# EAGLE design Autopilot Control Unit rev3 (EAGLE 9.6.2)
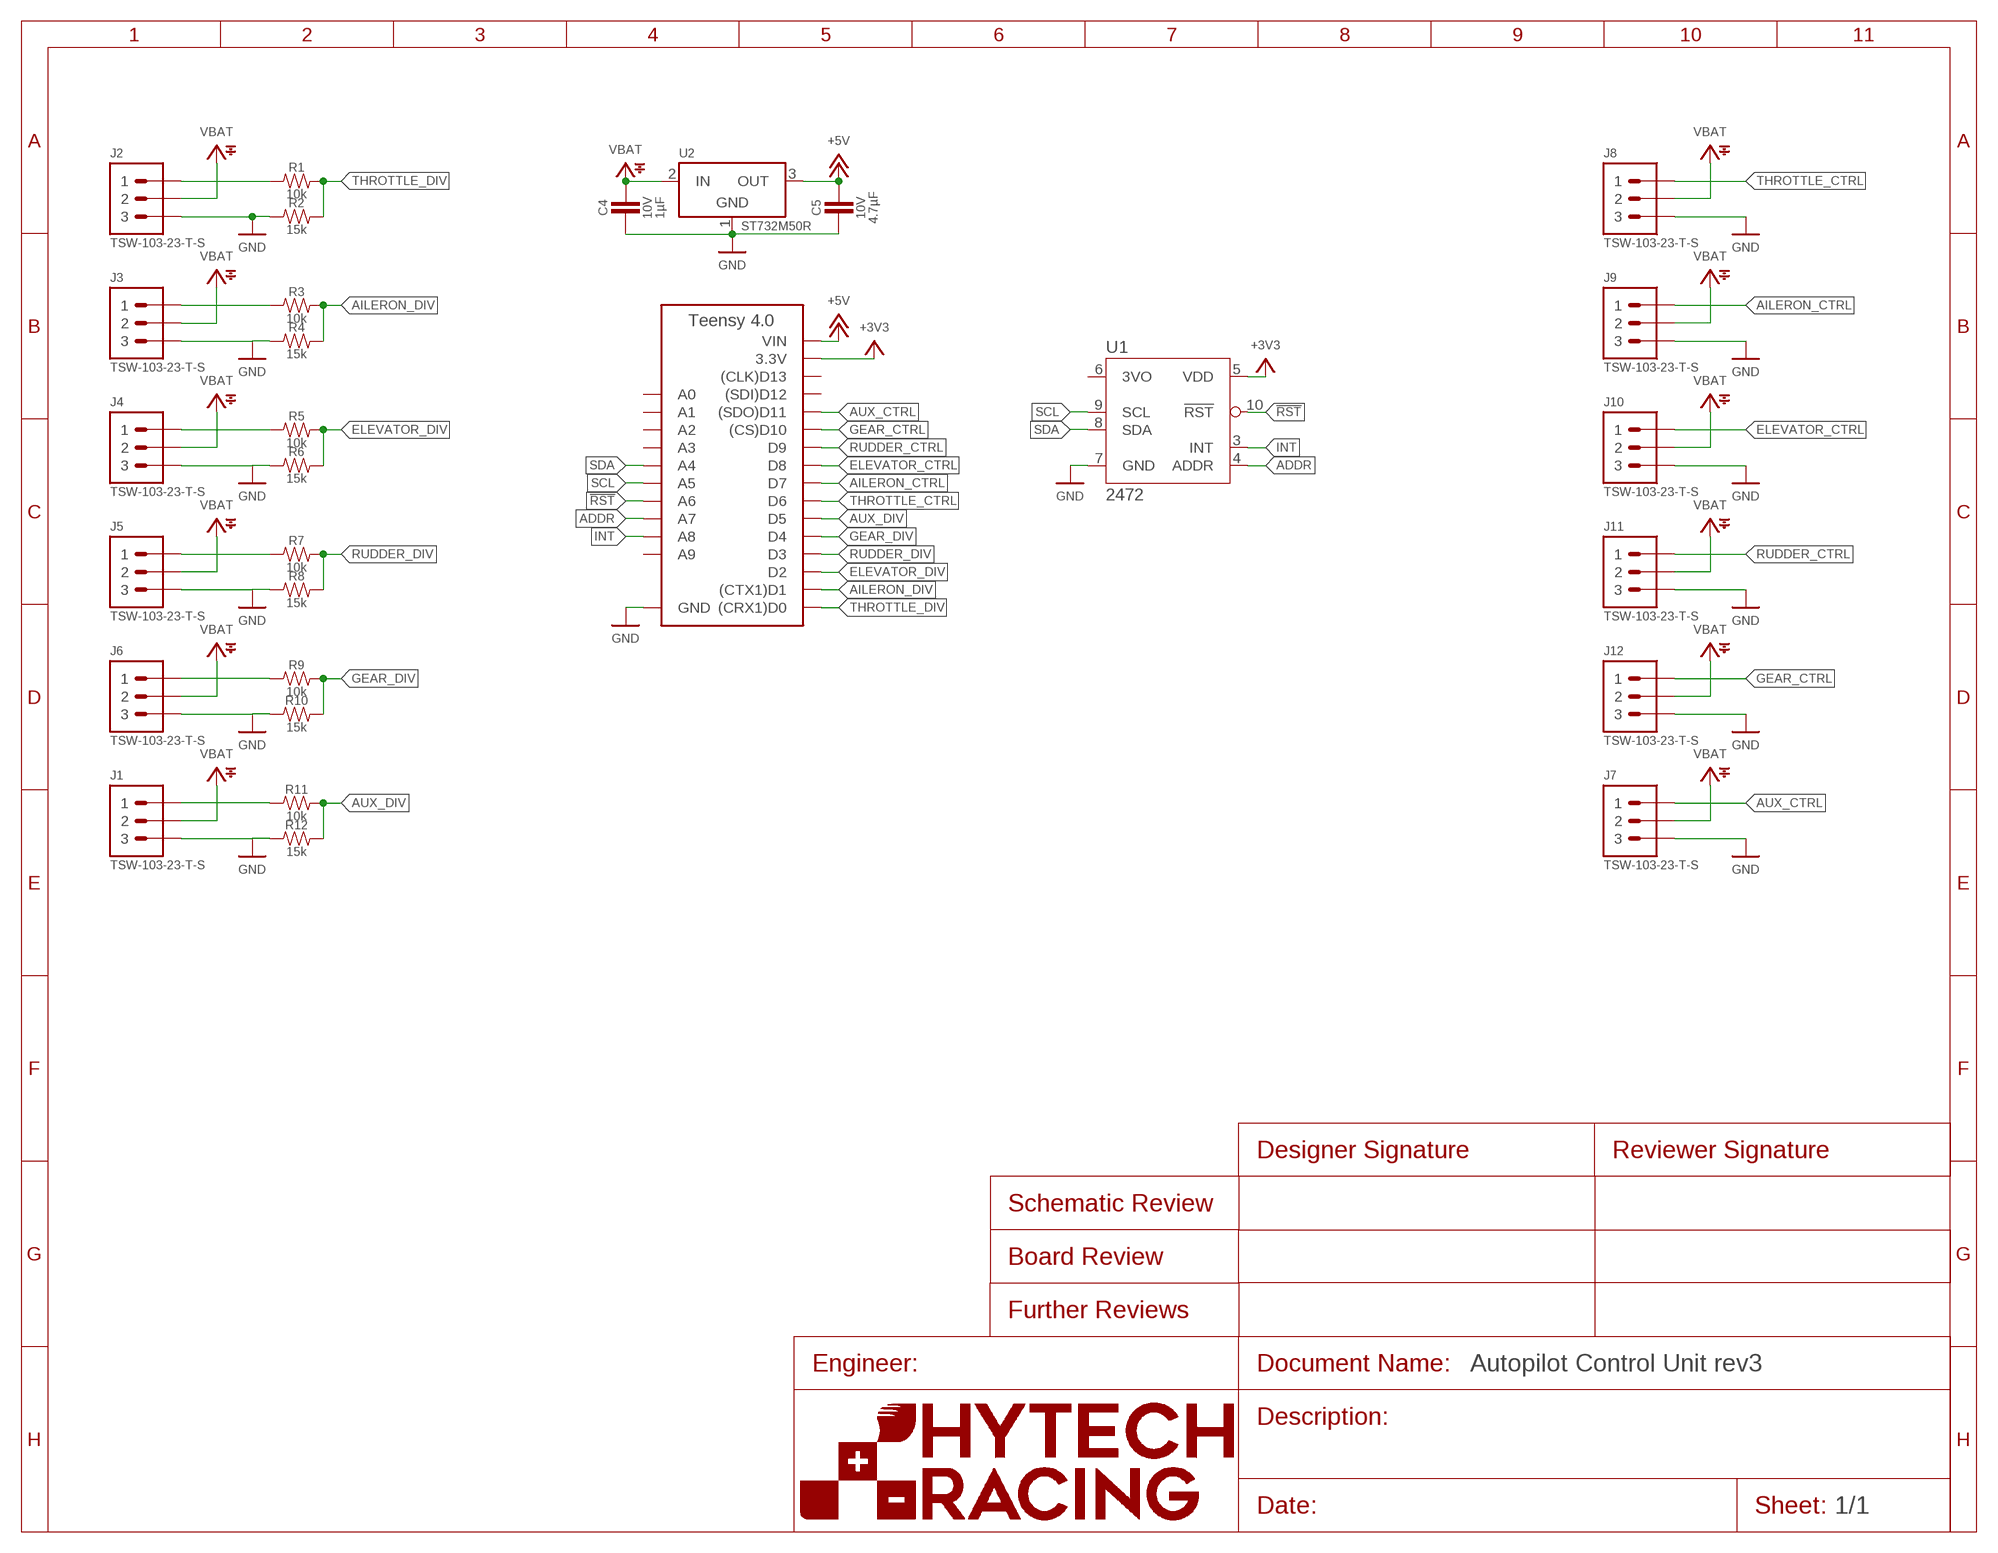
[diagram p0: schematic, sheet 1]

## Parts
A1  TEENSY_4.0TH  [TEENSY_SHORT]
C4  CAPACITOR_0603_10V_1UF  [0603-CAP]
C5  CAPACITOR_0603_10V_4.7UF  [0603-CAP]
J1  CONNECTOR_3__0.1"_INCH_TH  [0.1"_TH_HEADER]
J2  CONNECTOR_3__0.1"_INCH_TH  [0.1"_TH_HEADER]
J3  CONNECTOR_3__0.1"_INCH_TH  [0.1"_TH_HEADER]
J4  CONNECTOR_3__0.1"_INCH_TH  [0.1"_TH_HEADER]
J5  CONNECTOR_3__0.1"_INCH_TH  [0.1"_TH_HEADER]
J6  CONNECTOR_3__0.1"_INCH_TH  [0.1"_TH_HEADER]
J7  CONNECTOR_3__0.1"_INCH_TH  [0.1"_TH_HEADER]
J8  CONNECTOR_3__0.1"_INCH_TH  [0.1"_TH_HEADER]
J9  CONNECTOR_3__0.1"_INCH_TH  [0.1"_TH_HEADER]
J10  CONNECTOR_3__0.1"_INCH_TH  [0.1"_TH_HEADER]
J11  CONNECTOR_3__0.1"_INCH_TH  [0.1"_TH_HEADER]
J12  CONNECTOR_3__0.1"_INCH_TH  [0.1"_TH_HEADER]
R1  RESISTOR_0603_10K  [0603-RES]
R2  RESISTOR_0603_15K  [0603-RES]
R3  RESISTOR_0603_10K  [0603-RES]
R4  RESISTOR_0603_15K  [0603-RES]
R5  RESISTOR_0603_10K  [0603-RES]
R6  RESISTOR_0603_15K  [0603-RES]
R7  RESISTOR_0603_10K  [0603-RES]
R8  RESISTOR_0603_15K  [0603-RES]
R9  RESISTOR_0603_10K  [0603-RES]
R10  RESISTOR_0603_15K  [0603-RES]
R11  RESISTOR_0603_10K  [0603-RES]
R12  RESISTOR_0603_15K  [0603-RES]
U1  ADAFRUIT_BNO055  [ADAFRUIT_BNO055]
U2  VOLTAGE_REGULATOR_SOT-23-5_5V  [SOT-23-5]

## Nets
!RST: A1.D20(A6) U1.10(!RST)
+3V3: A1.3.3V U1.5(VDD)
+5V: A1.VIN C5.1 U2.3(OUT)
ADDR: A1.D21(A7) U1.4(ADDR)
AILERON_CTRL: A1.D7 J9.1
AILERON_DIV: A1.D1((CTX1)D1) R3.2 R4.2
AILERON_IN: J3.1 R3.1
AUX_CTRL: A1.D11((SDO)D11) J7.1
AUX_DIV: A1.D5 R11.2 R12.2
AUX_IN: J1.1 R11.1
ELEVATOR_CTRL: A1.D8 J10.1
ELEVATOR_DIV: A1.D2 R5.2 R6.2
ELEVATOR_IN: J4.1 R5.1
GEAR_CTRL: A1.D10((CS)D10) J12.1
GEAR_DIV: A1.D4 R9.2 R10.2
GEAR_IN: J6.1 R9.1
GND: A1.AGND/GND(GND) A1.GND C4.2 C5.2 J1.3 J2.3 J3.3 J4.3 J5.3 J6.3 J7.3 J8.3 J9.3 J10.3 J11.3 J12.3 R2.1 R4.1 R6.1 R8.1 R10.1 R12.1 U1.7(GND) U2.1(GND)
INT: A1.D22(A8) U1.3(INT)
RUDDER_CTRL: A1.D9 J11.1
RUDDER_DIV: A1.D3 R7.2 R8.2
RUDDER_IN: J5.1 R7.1
SCL: A1.D19(A5) U1.9(SCL)
SDA: A1.D18(A4) U1.8(SDA)
THROTTLE_CTRL: A1.D6 J8.1
THROTTLE_DIV: A1.D0((CRX1)D0) R1.2 R2.2
THROTTLE_IN: J2.1 R1.1
VBAT: C4.1 J1.2 J2.2 J3.2 J4.2 J5.2 J6.2 J7.2 J8.2 J9.2 J10.2 J11.2 J12.2 U2.2(IN)
Unconnected: A1.D12((SDI)D12) A1.D13((CLK)D13) A1.D14(A0) A1.D15(A1) A1.D16(A2) A1.D17(A3) A1.D23(A9)

## Power pins joined to a net without a drawn wire
3VO: U1.6(3VO)

## Library data of the parts
A1 = HyTechDevices:TEENSY_4.0: Teensy 4.0 Datasheet <https://www.pjrc.com/store/teensy40.html> Requires ordering of: 2: 14 pin, 0.1" pitch female headers. Recommend Samtec SSM-114-L-SV for surface mount variant.; TEENSY: 4.0
C4 = HyTechDevices:CAPACITOR_?_*: Capacitor, Non-Polarized VJ...1BC Series Datasheet <https://www.mouser.com/datasheet/2/427/vjw1bcbascomseries-1762447.pdf> Samsung Datasheet <https://www.mouser.com/datasheet/2/585/MLCC-1837944.pdf> Walsin Datasheet <https://www.mouser.com/datasheet/2/210/WTC_MLCC_General_Purpose-1534899.pdf> GRM188R61A226ME15D <https://www.mouser.com/datasheet/2/281/1/GRM188R61A226ME15_02A-1985787.pdf> GRM188R61E106MA73D <https://www.mouser.com/datasheet/2/281/1/GRM188R61E106MA73_01A-1985806.pdf> 885012006013 <https://www.mouser.com/datasheet/2/445/885012006013-1726946.pdf> 2220Y6300105KXTWS2 <https://www.mouser.com/datasheet/2/218/SMD_High_and_Std_StackiCap_P62-1825512.pdf> Yageo Class 2, X5R <https://www.mouser.com/datasheet/2/447/UPY_GPHC_X5R_4V_to_50V_26-1827097.pdf> TDK C Series <https://www.mouser.com/ProductDetail/TDK/C3216X5R1V226M160AC?qs=%2Fha2pyFadujbcx9jh7lYl%2F4NeMoXFhdc8AqVWNq4wW6M2y7zl6GzBuhgtI0ngznN> AVX Automotive MLCC <https://www.mouser.com/datasheet/2/40/AutoMLCC-777028.pdf> KEMET X7R Series <https://www.mouser.com/datasheet/2/212/KEM_C1002_X7R_SMD-1102033.pdf> Kyocera AVX <https://www.mouser.com/datasheet/2/40/C0GNP0_Dielectric-951274.pdf> GRM21BR61H <https://www.mouser.com/datasheet/2/281/1/GRM21BR61H106KE43_01A-1986884.pdf>; CAPACITANCE: 1µF; DKPN: 311-1796-1-ND; MANUFACTURER: Yageo; MOPN: 603-CC603KRX7R6BB105; MPN: CC0603KRX7R6BB105; TOLERANCE: 10%; VOLTAGE: 10V
C5 = HyTechDevices:CAPACITOR_?_*: Capacitor, Non-Polarized VJ...1BC Series Datasheet <https://www.mouser.com/datasheet/2/427/vjw1bcbascomseries-1762447.pdf> Samsung Datasheet <https://www.mouser.com/datasheet/2/585/MLCC-1837944.pdf> Walsin Datasheet <https://www.mouser.com/datasheet/2/210/WTC_MLCC_General_Purpose-1534899.pdf> GRM188R61A226ME15D <https://www.mouser.com/datasheet/2/281/1/GRM188R61A226ME15_02A-1985787.pdf> GRM188R61E106MA73D <https://www.mouser.com/datasheet/2/281/1/GRM188R61E106MA73_01A-1985806.pdf> 885012006013 <https://www.mouser.com/datasheet/2/445/885012006013-1726946.pdf> 2220Y6300105KXTWS2 <https://www.mouser.com/datasheet/2/218/SMD_High_and_Std_StackiCap_P62-1825512.pdf> Yageo Class 2, X5R <https://www.mouser.com/datasheet/2/447/UPY_GPHC_X5R_4V_to_50V_26-1827097.pdf> TDK C Series <https://www.mouser.com/ProductDetail/TDK/C3216X5R1V226M160AC?qs=%2Fha2pyFadujbcx9jh7lYl%2F4NeMoXFhdc8AqVWNq4wW6M2y7zl6GzBuhgtI0ngznN> AVX Automotive MLCC <https://www.mouser.com/datasheet/2/40/AutoMLCC-777028.pdf> KEMET X7R Series <https://www.mouser.com/datasheet/2/212/KEM_C1002_X7R_SMD-1102033.pdf> Kyocera AVX <https://www.mouser.com/datasheet/2/40/C0GNP0_Dielectric-951274.pdf> GRM21BR61H <https://www.mouser.com/datasheet/2/281/1/GRM21BR61H106KE43_01A-1986884.pdf>; CAPACITANCE: 4.7µF; DKPN: 1276-1044-1-ND; MANUFACTURER: Samsung Electro-Mechanics; MOPN: 187-CL10A475KP8NNNC; MPN: CL10A475KP8NNNC; TOLERANCE: 10%; VOLTAGE: 10V
J1-J12 = Devices:CONNECTOR_3_?_*; MPN: TSW-103-23-T-S
R1 R3 R5 R7 R9 R11 = HyTechDevices:RESISTOR_?_*: Resistor PWR163 Series <https://www.mouser.com/datasheet/2/54/pwr163-777985.pdf> AC Series <https://www.mouser.com/datasheet/2/447/Yageo_PYu_AC_51_RoHS_L_7_1714230-1874691.pdf> PU Series <https://www.mouser.com/datasheet/2/447/PYu-PU_51_RoHS_L_6-1504619.pdf> ERA Series <https://www.mouser.com/datasheet/2/315/AOA0000C307-1149632.pdf> PWR263 Series <https://www.mouser.com/datasheet/2/54/pwr263s_35-778069.pdf> KTR Series <https://www.mouser.com/datasheet/2/348/ROHM_S_A0011075115_1-2563276.pdf> RC Series <https://www.mouser.com/datasheet/2/447/Yageo_03_18_2021_PYu_RC_Group_51_RoHS_L_11-2199992.pdf> ERJ PB3, PB6 Series <https://www.mouser.com/datasheet/2/315/AOA0000C328-1530132.pdf> ERJ PA2, P03, PA3, P06, P08, P14 Series <https://www.mouser.com/datasheet/2/315/AOA0000C331-1141874.pdf> B20 Series <https://www.ohmite.com/assets/docs/res_200.pdf?r=false> TE Connectivity/Holsworthy RN73 Series <https://www.mouser.com/datasheet/2/418/4/NG_DS_1773270_M-604713.pdf> Vishay Dale D/CRCW e3 <https://www.mouser.com/datasheet/2/427/dcrcwe3-1762152.pdf> Ohmite B20 <https://www.ohmite.com/assets/docs/res_200.pdf?r=false>; DKPN: 311-10.0KHRCT-ND; MANUFACTURER: Yageo; MOPN: 603-RC0603FR-0710KL; MPN: RC0603FR-0710KL; POWER: 0.1W; RESISTANCE: 10k; TOLERANCE: 1%; VOLTAGE_CONTINUOUS: 31.62V; VOLTAGE_MAX: 75V
R2 R4 R6 R8 R10 R12 = HyTechDevices:RESISTOR_?_*: Resistor PWR163 Series <https://www.mouser.com/datasheet/2/54/pwr163-777985.pdf> AC Series <https://www.mouser.com/datasheet/2/447/Yageo_PYu_AC_51_RoHS_L_7_1714230-1874691.pdf> PU Series <https://www.mouser.com/datasheet/2/447/PYu-PU_51_RoHS_L_6-1504619.pdf> ERA Series <https://www.mouser.com/datasheet/2/315/AOA0000C307-1149632.pdf> PWR263 Series <https://www.mouser.com/datasheet/2/54/pwr263s_35-778069.pdf> KTR Series <https://www.mouser.com/datasheet/2/348/ROHM_S_A0011075115_1-2563276.pdf> RC Series <https://www.mouser.com/datasheet/2/447/Yageo_03_18_2021_PYu_RC_Group_51_RoHS_L_11-2199992.pdf> ERJ PB3, PB6 Series <https://www.mouser.com/datasheet/2/315/AOA0000C328-1530132.pdf> ERJ PA2, P03, PA3, P06, P08, P14 Series <https://www.mouser.com/datasheet/2/315/AOA0000C331-1141874.pdf> B20 Series <https://www.ohmite.com/assets/docs/res_200.pdf?r=false> TE Connectivity/Holsworthy RN73 Series <https://www.mouser.com/datasheet/2/418/4/NG_DS_1773270_M-604713.pdf> Vishay Dale D/CRCW e3 <https://www.mouser.com/datasheet/2/427/dcrcwe3-1762152.pdf> Ohmite B20 <https://www.ohmite.com/assets/docs/res_200.pdf?r=false>; DKPN: P15KBDCT-ND; MANUFACTURER: Panasonic Electronic Components; MOPN: 667-ERA-3ARB153V; MPN: ERA-3ARB153V; POWER: 0.1W; RESISTANCE: 15k; TOLERANCE: 0.1%; VOLTAGE_CONTINUOUS: 38.73V; VOLTAGE_MAX: 75V
U1 = Devices:ADAFRUIT_BNO055: Adafruit 9-DOF Absolute Orientation IMU Fusion Breakout - BNO055 <https://www.adafruit.com/product/2472#technical-details>; MPN: 2472
U2 = HyTechDevices:VOLTAGE_REGULATOR_?_*: Voltage Regulators LDL1117S50R Datasheet <https://www.mouser.com/datasheet/2/389/dm00366442-1799212.pdf> NCP785AH120T1G <https://www.mouser.com/datasheet/2/308/NCP785A_D-1812704.pdf> LMS8117A Datasheet <https://www.ti.com/lit/ds/symlink/lms8117a.pdf?HQS> ST732M50R Datasheet <https://www.mouser.com/datasheet/2/389/st732-1830546.pdf> LM2937IMPX-10/NOPB Datasheet <https://www.ti.com/lit/ds/symlink/lm2937.pdf>; DKPN: 497-ST732M50RTR-ND; MANUFACTURER: STMicroelectronics; MOPN: 511-ST732M50R; MPN: ST732M50R

## Board
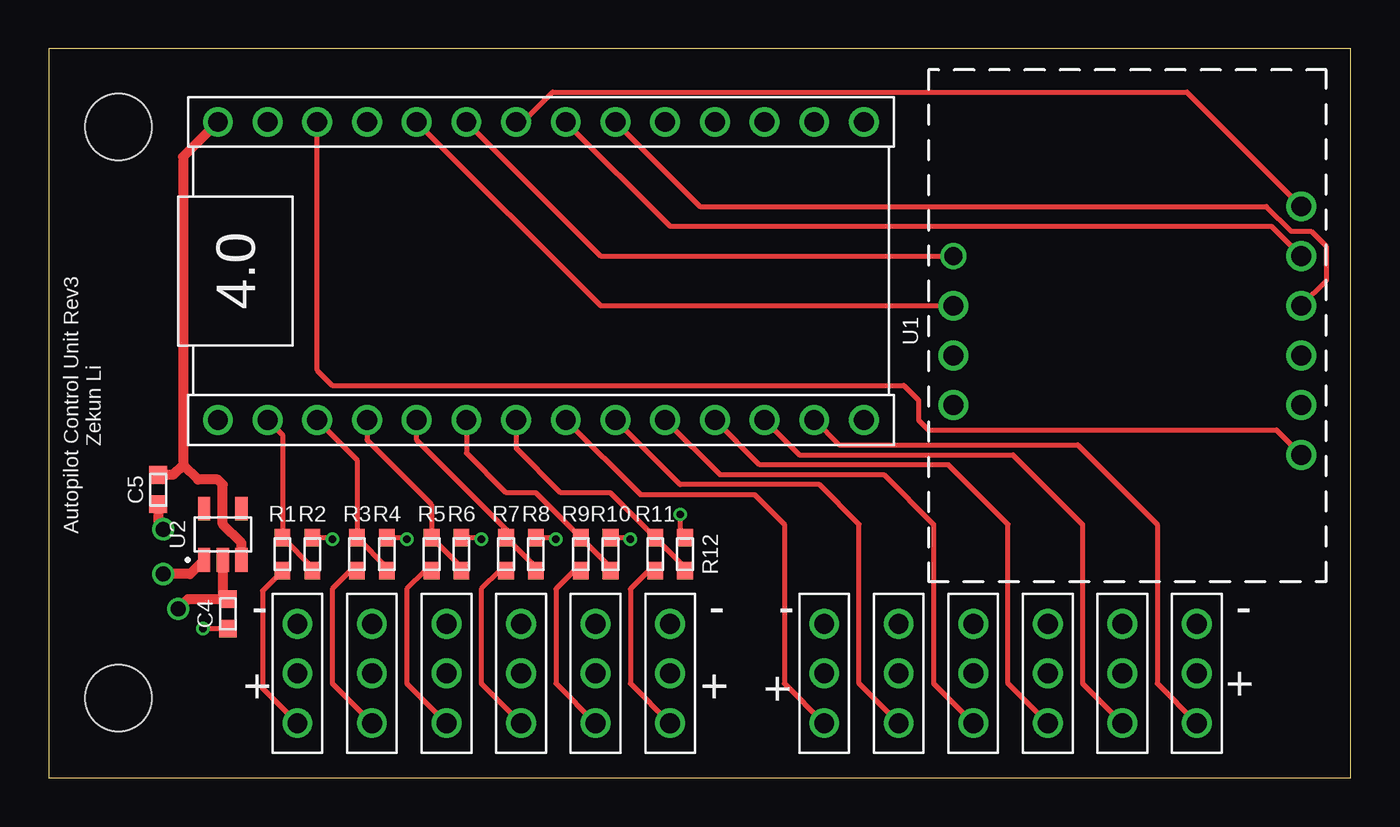
[diagram p1: board, top side]
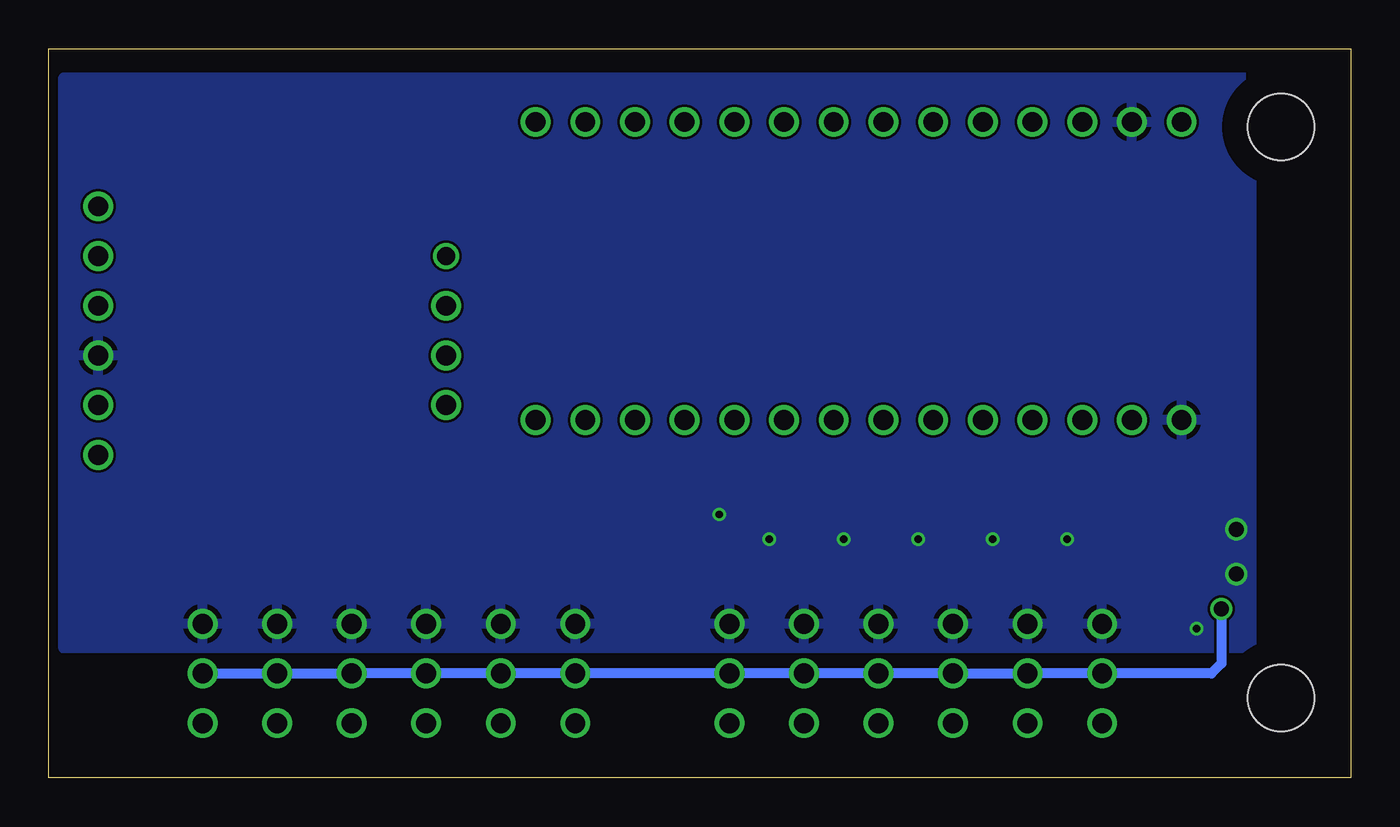
[diagram p2: board, bottom side, seen from below]

Size 66.53 x 37.26 mm. Coordinates in mm from the lower left corner, seen from the top.
Outline: 0,0 66.53,0 66.53,37.26 0,37.26 0,0
Copper layers (1*16): Top 0.035mm / dielectric 1.53mm / Bottom 0.035mm
Design rules "JLCPCB (2 Layer)": minimum track width 5mil, minimum drill 0.3mm, track to track 5mil, track to pad 5mil, pad to pad 5mil, via to via 20mil, smd to smd 5mil, copper to edge 0.2mm, drill to drill 21mil, minimum pad ring 6mil, minimum via ring 6mil, stop-mask expansion 6mil, vias tented up to drill 30mil, thermal gap 10mil

### Footprints (pad centres in the part's own frame; a part is rotated, then mirrored left to right if it is on the bottom)
TEENSY_SHORT = drill 1.016: 3.3V 0,5.08; AGND/GND 0,2.54; D0 15.24,2.54; D1 15.24,5.08; D2 15.24,7.62; D3 15.24,10.16; D4 15.24,12.7; D5 15.24,15.24; D6 15.24,17.78; D7 15.24,20.32; D8 15.24,22.86; D9 15.24,25.4; D10 15.24,27.94; D11 15.24,30.48; D12 15.24,33.02; D13 0,33.02; D14 0,30.48; D15 0,27.94; D16 0,25.4; D17 0,22.86; D18 0,20.32; D19 0,17.78; D20 0,15.24; D21 0,12.7; D22 0,10.16; D23 0,7.62; GND 15.24,0; VIN 0,0
0603-CAP = smd 0.9 x 0.9: 1 -0.75,0; 2 0.75,0
0.1"_TH_HEADER = drill 1.016: 1 0,2.54; 2 0,0; 3 0,-2.54
0603-RES = smd 0.9 x 0.8: 1 -0.85,0; 2 0.85,0
ADAFRUIT_BNO055 = drill 1.016: 1 -3.81,8.89; 2 -1.27,8.89; 3 1.27,8.89; 5 -6.35,-8.89; 6 -3.81,-8.89; 7 -1.27,-8.89; 8 1.27,-8.89; 9 3.81,-8.89; 10 6.35,-8.89 | drill 0.9: 4 3.81,8.89
SOT-23-5 = smd 0.62 x 1.22: 1 -0.95,-1.31; 2 0,-1.31; 3 0.95,-1.31; 4 0.95,1.31; 5 -0.95,1.31
MOUNTING_M3 = hole 3.4: 0,0

### Placement (x,y rotation side)
A1  8.64,33.53 270 top
C4  9.14,8.38 270 top
C5  5.59,14.73 270 top
J1  31.75,5.33 180 top
J2  12.7,5.33 180 top
J3  16.51,5.33 180 top
J4  20.32,5.33 180 top
J5  24.13,5.33 180 top
J6  27.94,5.33 180 top
J7  58.67,5.33 180 top
J8  39.62,5.33 180 top
J9  43.43,5.33 180 top
J10  47.24,5.33 180 top
J11  51.05,5.33 180 top
J12  54.86,5.33 180 top
R1  11.94,11.43 90 top
R2  13.46,11.43 270 top
R3  15.75,11.43 90 top
R4  17.27,11.43 270 top
R5  19.56,11.43 90 top
R6  21.08,11.43 270 top
R7  23.37,11.43 90 top
R8  24.89,11.43 270 top
R9  27.18,11.43 90 top
R10  28.7,11.43 270 top
R11  30.99,11.43 90 top
R12  32.51,11.43 270 top
U1  55.12,22.86 90 top
U2  8.89,12.45 0 top
U$1  [MOUNTING_M3]  3.56,4.06 0 top
U$2  [MOUNTING_M3]  3.56,33.27 0 top

### Tracks (layer width: path | path; a pad name or v marks a point on that pad's centre or on a via)
!RST
  Top 0.254: A1.D20 24.22,33.53 25.74,35.05 58.17,35.05 U1.10
+3V3
  Top 0.254: A1.3.3V 13.72,20.83 14.48,20.07 43.69,20.07 44.45,19.3 44.45,18.29 44.96,17.78 62.74,17.78 U1.5
+5V
  Top 0.508: U2.3 9.84,12 8.89,12.95 8.89,14.99 8.64,15.24 7.62,15.24 6.86,16 | 6.86,16 6.86,31.75 A1.VIN | 6.86,16 6.34,15.48 C5.1
ADDR
  Top 0.254: A1.D21 28.19,26.67 U1.4
AILERON_CTRL
  Top 0.254: J9.1 41.4,4.83 41.4,12.95 39.37,14.99 32.26,14.99 A1.D7
AILERON_DIV
  Top 0.254: R4.2 17.27,10.76 R3.2 15.75,16.26 A1.D1
AILERON_IN
  Top 0.254: R3.1 15.41,10.58 14.48,9.65 14.48,4.83 J3.1
AUX_CTRL
  Top 0.254: A1.D11 40.39,17.02 52.58,17.02 56.64,12.95 56.64,4.83 J7.1
AUX_DIV
  Top 0.254: R12.2 32.51,10.76 R11.2 28.7,14.57 26.16,14.57 23.88,16.85 A1.D5
AUX_IN
  Top 0.254: R11.1 30.65,10.58 29.72,9.65 29.72,4.83 J1.1
ELEVATOR_CTRL
  Top 0.254: A1.D8 34.29,15.49 42.67,15.49 45.21,12.95 45.21,4.83 J10.1
ELEVATOR_DIV
  Top 0.254: R6.2 21.08,10.76 R5.2 19.56,13.97 16.26,17.27 A1.D2
ELEVATOR_IN
  Top 0.254: R5.1 19.22,10.58 18.29,9.65 18.29,4.83 J4.1
GEAR_CTRL
  Top 0.254: A1.D10 38.35,16.51 49.28,16.51 52.83,12.95 52.83,4.83 J12.1
GEAR_DIV
  Top 0.254: R10.2 28.7,10.76 R9.2 24.89,14.57 23.37,14.57 21.34,16.6 A1.D4
GEAR_IN
  Top 0.254: R9.1 26.84,10.58 25.91,9.65 25.91,4.83 J6.1
GND  (via drill 0.38, 0.76)
  Top 0.254: R2.1 14.39,12.28 v14.48,12.19 | R4.1 18.2,12.28 v18.29,12.19 | R6.1 22.01,12.28 v22.1,12.19 | R8.1 25.82,12.28 v25.91,12.19 | R10.1 29.63,12.28 v29.72,12.19 | v32.26,13.46 32.26,12.53 R12.1 | C4.2 v7.87,7.62
  Top 0.508: U2.1 7.22,10.41 v5.84,10.41 | C5.2 5.59,12.95 v5.84,12.7
  pour Bottom: 5.08,35.81 5.08,6.6 65.79,6.6 65.79,35.81
INT
  Top 0.254: A1.D22 28.19,24.13 U1.3
RUDDER_CTRL
  Top 0.254: A1.D9 36.32,16 45.97,16 49.02,12.95 49.02,4.83 J11.1
RUDDER_DIV
  Top 0.254: R8.2 24.89,10.76 R7.2 23.37,12.7 18.8,17.27 A1.D3
RUDDER_IN
  Top 0.254: R7.1 23.03,10.58 22.1,9.65 22.1,4.83 J5.1
SCL
  Top 0.254: A1.D19 31.75,28.19 62.48,28.19 U1.9
SDA
  Top 0.254: A1.D18 33.27,29.21 62.23,29.21 63.5,27.94 64.52,27.94 65.28,27.18 65.28,25.4 U1.8
THROTTLE_CTRL
  Top 0.254: A1.D6 30.23,14.48 36.07,14.48 37.59,12.95 37.59,4.83 J8.1
THROTTLE_DIV
  Top 0.254: R2.2 13.46,10.76 R1.2 11.94,17.53 A1.D0
THROTTLE_IN
  Top 0.254: R1.1 10.92,9.56 10.92,4.57 J2.1
VBAT  (via drill 0.76)
  Top 0.508: U2.2 8.89,9.39 C4.1 7.1,9.13 v6.6,8.64
  Bottom 0.508: v6.6,8.64 6.6,5.84 7.11,5.33 J2.2 J3.2 J4.2 J5.2 J6.2 J1.2 J8.2 J9.2 J10.2 J11.2 J12.2 J7.2

### Text on the board
tNames: Autopilot Control Unit Rev3 / Zekun Li | - | - | - | - | + | + | + | +